# EAGLE design sencerMain2kai (EAGLE 7.4.0)
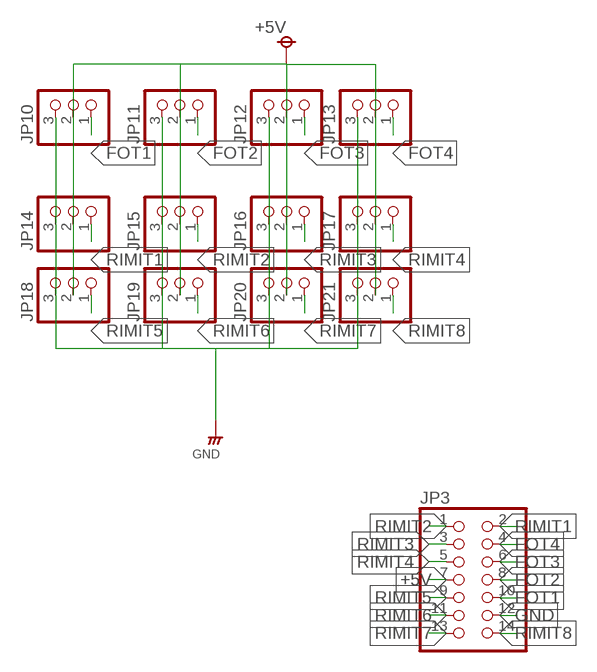
[diagram p0: schematic, sheet 1]

## Parts
JP3  PINHD-2X7  [2X07]
JP10  PINHD-1X3-1  [1*03]
JP11  PINHD-1X3-1  [1*03]
JP12  PINHD-1X3-1  [1*03]
JP13  PINHD-1X3-1  [1*03]
JP14  PINHD-1X3-1  [1*03]
JP15  PINHD-1X3-1  [1*03]
JP16  PINHD-1X3-1  [1*03]
JP17  PINHD-1X3-1  [1*03]
JP18  PINHD-1X3-1  [1*03]
JP19  PINHD-1X3-1  [1*03]
JP20  PINHD-1X3-1  [1*03]
JP21  PINHD-1X3-1  [1*03]

## Nets
+5V: JP3.7 JP10.2 JP11.2 JP12.2 JP13.2 JP14.2 JP15.2 JP16.2 JP17.2 JP18.2 JP19.2 JP20.2 JP21.2
FOT1: JP3.10 JP10.1
FOT2: JP3.8 JP11.1
FOT3: JP3.6 JP12.1
FOT4: JP3.4 JP13.1
GND: JP3.12 JP10.3 JP11.3 JP13.3 JP14.3 JP15.3 JP17.3 JP18.3 JP19.3 JP21.3
N$25: JP12.3 JP16.3 JP20.3
RIMIT1: JP3.2 JP14.1
RIMIT2: JP3.1 JP15.1
RIMIT3: JP3.3 JP16.1
RIMIT4: JP3.5 JP17.1
RIMIT5: JP3.9 JP18.1
RIMIT6: JP3.11 JP19.1
RIMIT7: JP3.13 JP20.1
RIMIT8: JP3.14 JP21.1

## Library data of the parts
JP3 = pinhead_s:PINHD-2X7: PIN HEADER
JP10-JP21 = pinhead_s:PINHD-1X3: PIN HEADER

## Board
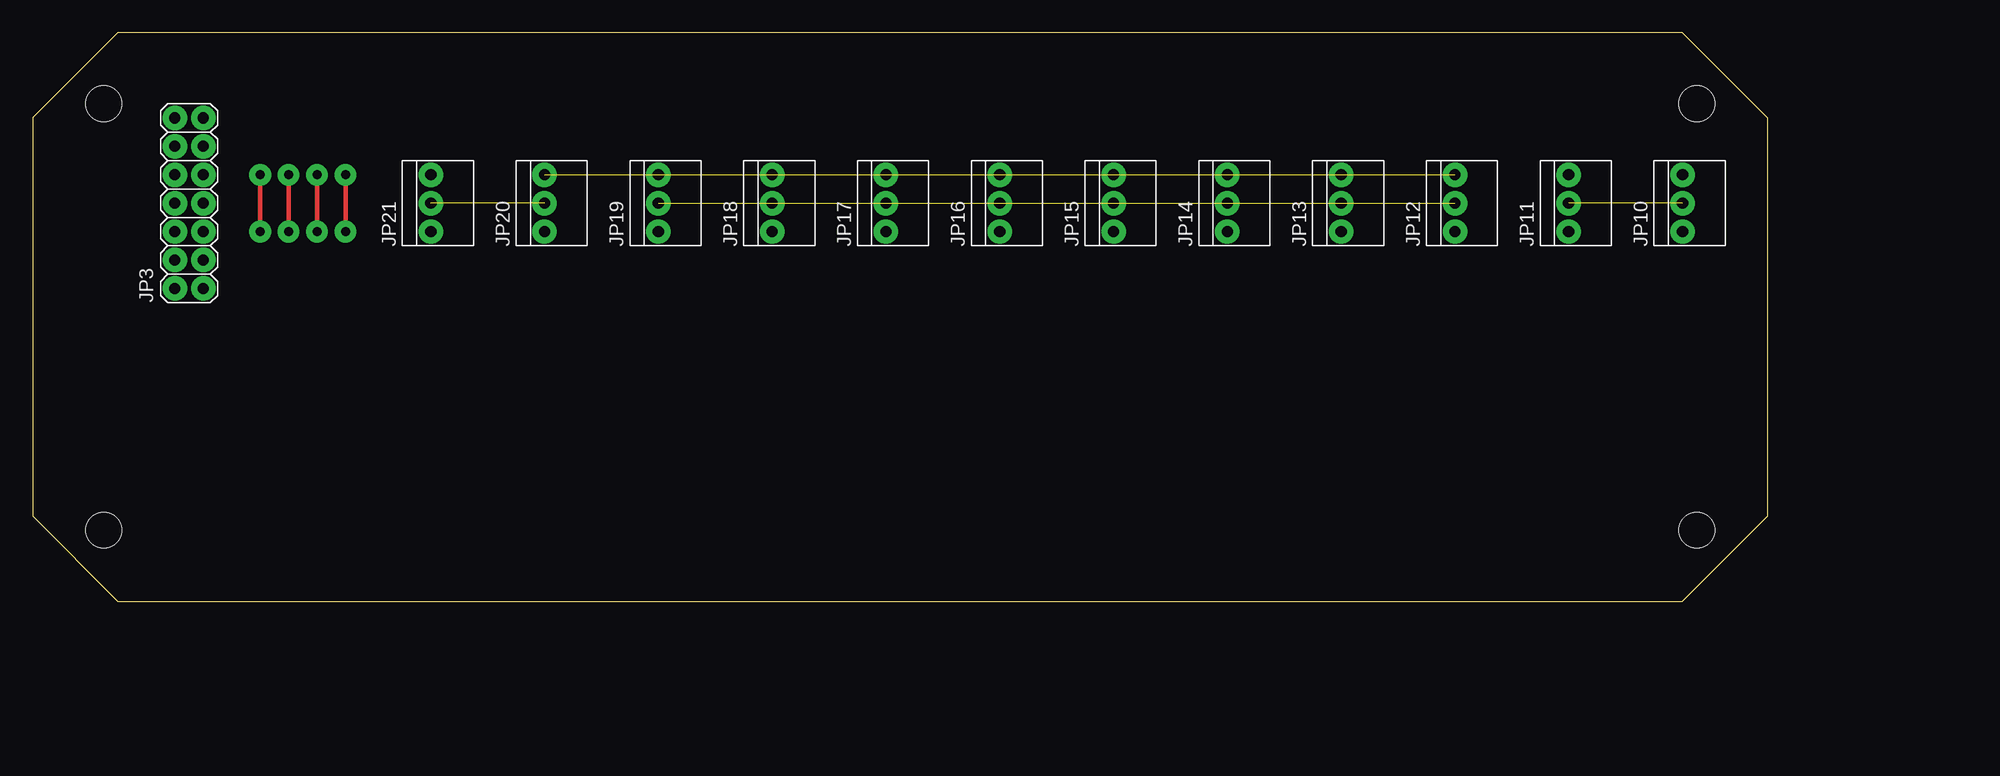
[diagram p1: board, top side]
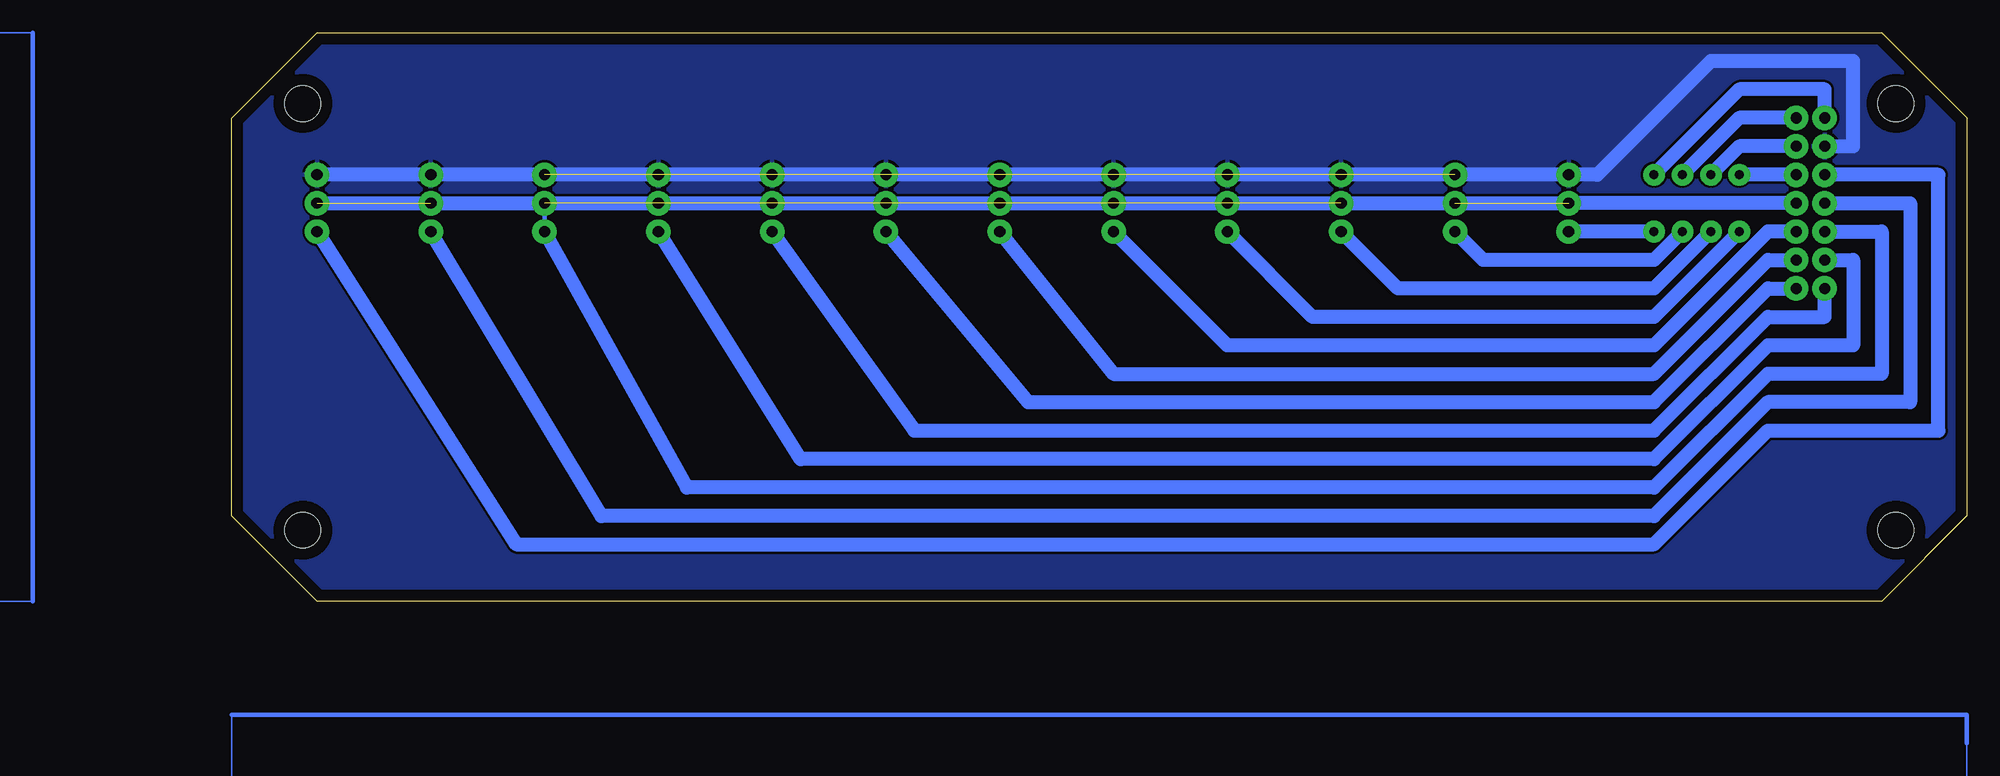
[diagram p2: board, bottom side, seen from below]

Size 154.94 x 50.8 mm. Coordinates in mm from the lower left corner, seen from the top.
Outline: 154.94,7.62 154.94,43.16 147.32,50.78 147.32,50.8 7.62,50.8 7.62,50.78 5.08,48.24 0,43.18 0,7.62 7.62,0 147.32,0 154.94,7.62
Copper layers (1*16): Top 0.035mm / dielectric 1.5mm / Bottom 0.035mm
Design rules "default": minimum track width 10mil, minimum drill 24mil, track to track 8mil, track to pad 8mil, pad to pad 8mil, via to via 8mil, smd to smd 8mil, copper to edge 40mil, drill to drill 8mil, minimum pad ring 10mil, minimum via ring 8mil, stop-mask expansion 4mil, vias tented up to drill 0mil, thermal gap 10mil
Holes 3.2 mm at 6.35,6.35 6.35,44.45 148.59,44.45 148.59,6.35

### Footprints (pad centres in the part's own frame; a part is rotated, then mirrored left to right if it is on the bottom)
2X07 = drill 1 pad 2.184: 1 -7.62,-1.27; 2 -7.62,1.27; 3 -5.08,-1.27; 4 -5.08,1.27; 5 -2.54,-1.27; 6 -2.54,1.27; 7 0,-1.27; 8 0,1.27; 9 2.54,-1.27; 10 2.54,1.27; 11 5.08,-1.27; 12 5.08,1.27; 13 7.62,-1.27; 14 7.62,1.27
1*03 = drill 1 pad 2.184: 1 -2.54,0; 2 0,0; 3 2.54,0

### Placement (x,y rotation side)
JP3  13.97,35.56 90 top
JP10  147.32,35.56 90 top
JP11  137.16,35.56 90 top
JP12  127,35.56 90 top
JP13  116.84,35.56 90 top
JP14  106.68,35.56 90 top
JP15  96.52,35.56 90 top
JP16  86.36,35.56 90 top
JP17  76.2,35.56 90 top
JP18  66.04,35.56 90 top
JP19  55.88,35.56 90 top
JP20  45.72,35.56 90 top
JP21  35.56,35.56 90 top

### Tracks (layer width: path | path; a pad name or v marks a point on that pad's centre or on a via)
+5V  (9 unrouted)
  Bottom 0.406: JP21.2 JP12.2
  Bottom 1.27: JP3.7 JP21.2 JP10.2
FOT1
  Bottom 1.27: JP10.1 129.54,5.08 27.94,5.08 17.78,15.24 2.54,15.24 2.54,38.1 JP3.10
FOT2
  Bottom 1.27: JP3.8 5.08,35.56 5.08,17.78 17.78,17.78 27.94,7.62 121.92,7.62 JP11.1
FOT3
  Bottom 0.406: 127,35.56 JP12.1
  Bottom 1.27: JP3.6 7.62,33.02 7.62,20.32 17.78,20.32 27.94,10.16 114.3,10.16 JP12.1
FOT4
  Bottom 1.27: JP3.4 10.16,30.48 10.16,22.86 17.78,22.86 27.94,12.7 104.14,12.7 JP13.1
GND
  Bottom 1.27: JP3.12 10.16,40.64 10.16,48.26 22.86,48.26 33.02,38.1 JP10.3
  pour Bottom: 7.62,50.16 0.63,43.18 0.63,7.62 7.62,0.63 147.32,0.63 154.31,7.62 154.31,43.18 147.32,50.16
N$1
  Bottom 0.406: 172.72,0 172.72,50.8
N$2
  Bottom 0.406: 154.94,-10.16 0,-10.16 0,-12.7
N$25  (2 unrouted)
RIMIT1
  Bottom 1.27: JP14.1 93.98,15.24 27.94,15.24 17.78,25.4 12.7,25.4 JP3.2
RIMIT2
  Bottom 1.27: JP3.1 17.78,27.94 27.94,17.78 83.82,17.78 JP15.1
RIMIT3
  Bottom 1.27: JP16.1 76.2,20.32 27.94,20.32 17.78,30.48 JP3.3
RIMIT4
  Bottom 1.27: JP3.5 17.78,33.02 27.94,22.86 66.04,22.86 JP17.1
RIMIT5  (via drill 0.8 pad 1.93)
  Top 0.406: v20.32,38.1 v20.32,33.02
  Bottom 1.27: JP3.9 v20.32,38.1 | v20.32,33.02 27.94,25.4 58.42,25.4 JP18.1
RIMIT6  (via drill 0.8 pad 1.93)
  Top 0.406: v22.86,38.1 v22.86,33.02
  Bottom 1.27: JP3.11 20.32,40.64 v22.86,38.1 | v22.86,33.02 27.94,27.94 50.8,27.94 JP19.1
RIMIT7  (via drill 0.8 pad 1.93)
  Top 0.406: v25.4,38.1 v25.4,33.02
  Bottom 1.27: JP3.13 20.32,43.18 v25.4,38.1 | v25.4,33.02 27.94,30.48 43.18,30.48 JP20.1
RIMIT8  (via drill 0.8 pad 1.93)
  Top 0.406: v27.94,38.1 v27.94,33.02
  Bottom 1.27: JP3.14 12.7,45.72 20.32,45.72 v27.94,38.1 | v27.94,33.02 JP21.1
(copper drawn outside any net)
  shapes: Bottom area x2